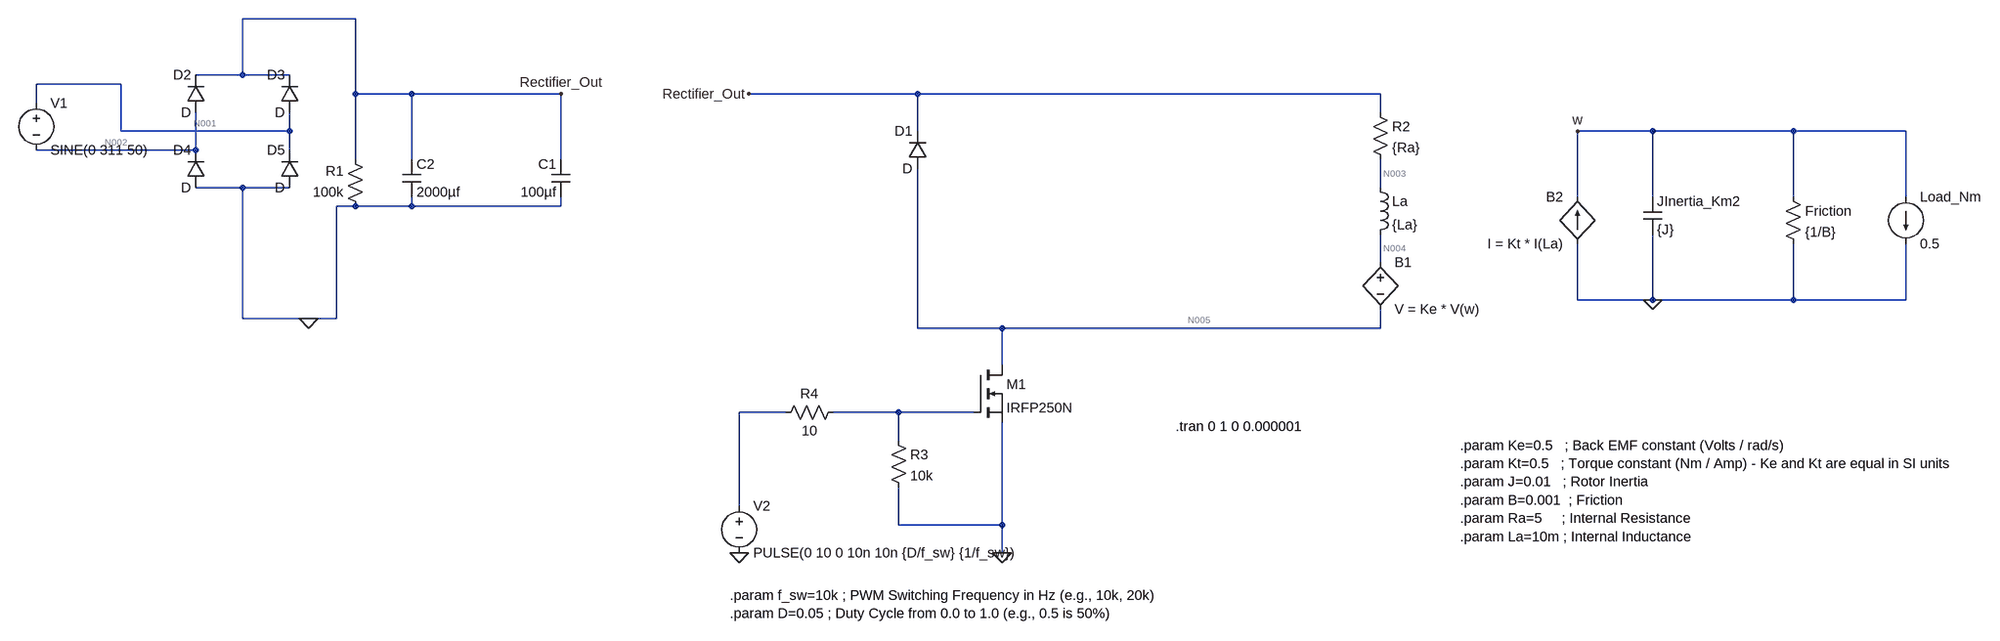
[diagram p0: schematic Ltspice_sim.asc]
Ltspice_sim.asc, the LTspice schematic file:
Version 4.1
SHEET 1 2756 804
WIRE -304 -224 -496 -224
WIRE -496 -128 -496 -224
WIRE -496 -128 -576 -128
WIRE -416 -128 -496 -128
WIRE -704 -112 -848 -112
WIRE -304 -96 -304 -224
WIRE -208 -96 -304 -96
WIRE 48 -96 -208 -96
WIRE 656 -96 368 -96
WIRE 1472 -96 656 -96
WIRE -848 -80 -848 -112
WIRE 1472 -64 1472 -96
WIRE -704 -32 -704 -112
WIRE -416 -32 -416 -64
WIRE -416 -32 -704 -32
WIRE 656 -32 656 -96
WIRE 1936 -32 1808 -32
WIRE 2176 -32 1936 -32
WIRE 2368 -32 2176 -32
WIRE -576 0 -576 -64
WIRE -576 0 -848 0
WIRE -416 0 -416 -32
WIRE -304 16 -304 -96
WIRE -208 16 -208 -96
WIRE 48 16 48 -96
WIRE -496 64 -576 64
WIRE -416 64 -496 64
WIRE 1472 64 1472 16
WIRE 1808 80 1808 -32
WIRE 1936 80 1936 -32
WIRE 2176 80 2176 -32
WIRE 2368 80 2368 -32
WIRE -304 96 -336 96
WIRE -208 96 -208 80
WIRE -208 96 -304 96
WIRE 48 96 48 80
WIRE 48 96 -208 96
WIRE 1472 192 1472 144
WIRE 1808 256 1808 160
WIRE 1936 256 1936 144
WIRE 1936 256 1808 256
WIRE 2176 256 2176 160
WIRE 2176 256 1936 256
WIRE 2368 256 2368 160
WIRE 2368 256 2176 256
WIRE -496 288 -496 64
WIRE -384 288 -496 288
WIRE -336 288 -336 96
WIRE -336 288 -384 288
WIRE 656 304 656 32
WIRE 800 304 656 304
WIRE 1472 304 1472 272
WIRE 1472 304 800 304
WIRE 800 368 800 304
WIRE 432 448 352 448
WIRE 624 448 512 448
WIRE 752 448 624 448
WIRE 624 496 624 448
WIRE 352 608 352 448
WIRE 624 640 624 576
WIRE 800 640 800 464
WIRE 800 640 624 640
WIRE 800 688 800 640
FLAG 352 688 0
FLAG 800 688 0
FLAG -384 288 0
FLAG 1936 256 0
FLAG 1808 -32 w
FLAG 48 -96 Rectifier_Out
FLAG 368 -96 Rectifier_Out
SYMBOL res -288 112 R180
WINDOW 0 36 76 Left 2
WINDOW 3 36 40 Left 2
SYMATTR InstName R1
SYMATTR Value 100k
SYMBOL voltage -848 -96 R0
WINDOW 123 0 0 Left 0
WINDOW 39 0 0 Left 0
SYMATTR InstName V1
SYMATTR Value SINE(0 311 50)
SYMBOL cap 64 80 R180
WINDOW 0 24 56 Left 2
WINDOW 3 24 8 Left 2
SYMATTR InstName C1
SYMATTR Value 100µf
SYMBOL diode 672 32 R180
WINDOW 0 24 64 Left 2
WINDOW 3 24 0 Left 2
SYMATTR InstName D1
SYMBOL diode -560 -64 R180
WINDOW 0 24 64 Left 2
WINDOW 3 24 0 Left 2
SYMATTR InstName D2
SYMBOL diode -400 -64 R180
WINDOW 0 24 64 Left 2
WINDOW 3 24 0 Left 2
SYMATTR InstName D3
SYMBOL diode -560 64 R180
WINDOW 0 24 64 Left 2
WINDOW 3 24 0 Left 2
SYMATTR InstName D4
SYMBOL diode -400 64 R180
WINDOW 0 24 64 Left 2
WINDOW 3 24 0 Left 2
SYMATTR InstName D5
SYMBOL voltage 352 592 R0
WINDOW 123 0 0 Left 0
WINDOW 39 0 0 Left 0
SYMATTR InstName V2
SYMATTR Value PULSE(0 10 0 10n 10n {D/f_sw} {1/f_sw})
SYMBOL res 608 480 R0
SYMATTR InstName R3
SYMATTR Value 10k
SYMBOL res 528 432 R90
WINDOW 0 0 56 VBottom 2
WINDOW 3 32 56 VTop 2
SYMATTR InstName R4
SYMATTR Value 10
SYMBOL nmos 752 368 R0
SYMATTR InstName M1
SYMATTR Value IRFP250N
SYMBOL cap -224 16 R0
SYMATTR InstName C2
SYMATTR Value 2000µf
SYMBOL res 1456 -80 R0
SYMATTR InstName R2
SYMATTR Value {Ra}
SYMBOL ind 1456 48 R0
SYMATTR InstName La
SYMATTR Value {La}
SYMATTR SpiceLine Rser=0
SYMBOL bv 1472 176 R0
SYMATTR InstName B1
SYMATTR Value V = Ke * V(w)
SYMBOL bi 1808 160 R180
WINDOW 0 24 80 Left 2
WINDOW 3 24 0 Left 2
SYMATTR InstName B2
SYMATTR Value I = Kt * I(La)
SYMBOL cap 1920 80 R0
SYMATTR InstName JInertia_Km2
SYMATTR Value {J}
SYMBOL res 2160 64 R0
SYMATTR InstName Friction
SYMATTR Value {1/B}
SYMBOL current 2368 80 R0
WINDOW 123 0 0 Left 0
WINDOW 39 0 0 Left 0
SYMATTR InstName Load_Nm
SYMATTR Value 0.5
TEXT 1096 472 Left 2 !.tran 0 1 0 0.000001
TEXT 1608 504 Left 2 !.param Ke=0.5   ; Back EMF constant (Volts / rad/s)\n.param Kt=0.5   ; Torque constant (Nm / Amp) - Ke and Kt are equal in SI units\n.param J=0.01   ; Rotor Inertia\n.param B=0.001  ; Friction\n.param Ra=5     ; Internal Resistance\n.param La=10m ; Internal Inductance
TEXT 336 760 Left 2 !.param f_sw=10k ; PWM Switching Frequency in Hz (e.g., 10k, 20k)\n.param D=0.05 ; Duty Cycle from 0.0 to 1.0 (e.g., 0.5 is 50%)

The netlist it stands for:
* Ltspice_sim.asc
R1 0 Rectifier_Out 100k
V1 N001 N002 SINE(0 311 50)
C1 0 Rectifier_Out 100µf
D1 N005 Rectifier_Out D
D2 N002 Rectifier_Out D
D3 N001 Rectifier_Out D
D4 0 N002 D
D5 0 N001 D
V2 N006 0 PULSE(0 10 0 10n 10n {D/f_sw} {1/f_sw})
R3 N007 0 10k
R4 N007 N006 10
M1 N005 N007 0 0 IRFP250N
C2 Rectifier_Out 0 2000µf
R2 Rectifier_Out N003 {Ra}
La N003 N004 {La} Rser=0
B1 N004 N005 V = Ke * V(w)
B2 0 w I = Kt * I(La)
C§JInertia_Km2 w 0 {J}
R§Friction w 0 {1/B}
I§Load_Nm w 0 0.5
.model D D
.lib standard.dio
.model NMOS NMOS
.model PMOS PMOS
.lib standard.mos
.tran 0 1 0 0.000001
.param Ke=0.5   ; Back EMF constant (Volts / rad/s)
.param Kt=0.5   ; Torque constant (Nm / Amp) - Ke and Kt are equal in SI units
.param J=0.01   ; Rotor Inertia
.param B=0.001  ; Friction
.param Ra=5     ; Internal Resistance
.param La=10m ; Internal Inductance
.param f_sw=10k ; PWM Switching Frequency in Hz (e.g., 10k, 20k)
.param D=0.05 ; Duty Cycle from 0.0 to 1.0 (e.g., 0.5 is 50%)
.backanno
.end

* Results of the author's LTspice run, read from the files saved beside the schematic
* Operating Point, zero values left out:
*   V(n001) = -333.3 nV
*   V(n002) = -333.3 nV
*   V(n003) = -4.886 V
*   V(n004) = -4.886 V
*   V(n005) = 833.2 mV
*   V(rectifier_out) = -666.6 nV
*   V(w) = -11.44 V
*   I(B1) = 977.1 mA
*   I(B2) = 488.6 mA
*   I(D1) = 977.1 mA
*   I(Friction) = -11.44 mA
*   I(La) = 977.1 mA
*   I(Load_Nm) = 500 mA
*   I(R1) = 6.666 pA
*   I(R2) = 977.1 mA
*   Id(M1) = 5.829 pA
*   Is(M1) = -5.829 pA